# Altium schematic sheet power_supply.SchDoc
size A4
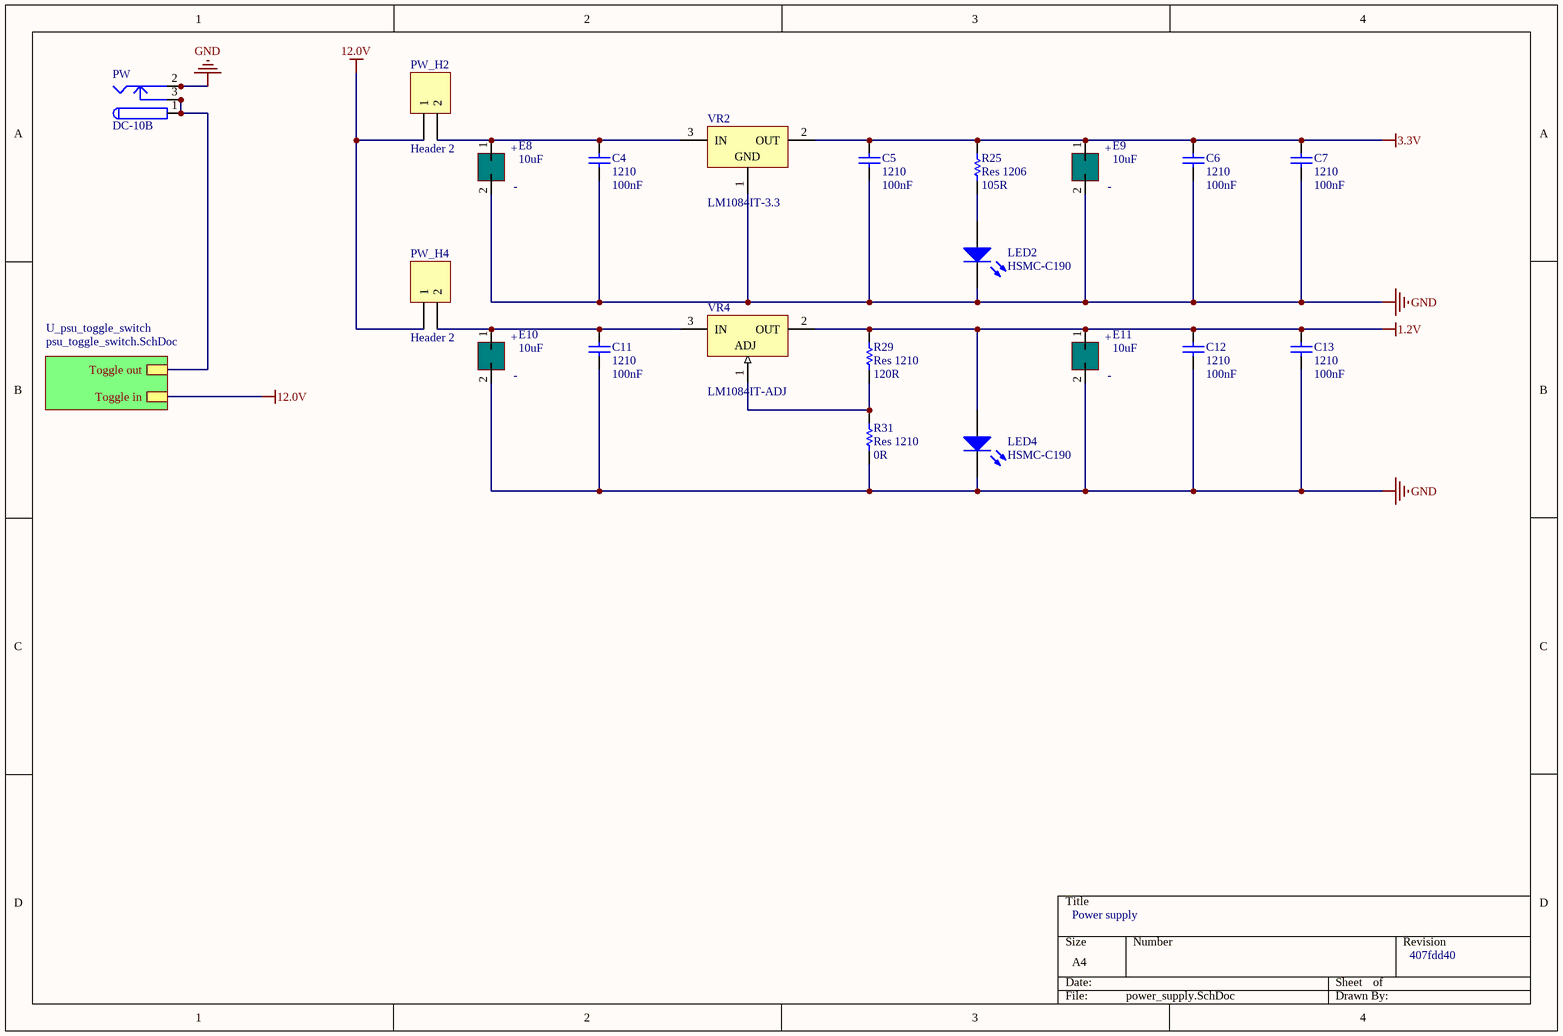
[diagram p0: power_supply.SchDoc]

## Parts
C4  1210  value 100nF  [CAPC1210(3225)105_L]
C5  1210  value 100nF  [CAPC1210(3225)105_L]
C6  1210  value 100nF  [CAPC1210(3225)105_L]
C7  1210  value 100nF  [CAPC1210(3225)105_L]
C11  1210  value 100nF  [CAPC1210(3225)105_L]
C12  1210  value 100nF  [CAPC1210(3225)105_L]
C13  1210  value 100nF  [CAPC1210(3225)105_L]
E8  10uF  [cap_pol_size_B]
E9  10uF  [cap_pol_size_B]
E10  10uF  [cap_pol_size_B]
E11  10uF  [cap_pol_size_B]
LED2  HSMC-C190  [1.6X0.8X0.8]
LED4  HSMC-C190  [1.6X0.8X0.8]
PW  DC-10B  [KLD-0202]
PW_H2  Header 2  [HDR1X2]
PW_H4  Header 2  [HDR1X2]
R25  Res 1206  value 105R  [RESC1206(3216)_L]
R29  Res 1210  value 120R  [RESC1210(3225)_M]
R31  Res 1210  value 0R  [RESC1210(3225)_M]
VR2  LM1084IT-3.3  [T03B]
VR4  LM1084IT-ADJ  [T03B]

## Sub-sheets
U_psu_toggle_switch = psu_toggle_switch.SchDoc: Toggle in, Toggle out

## Nets
1.2V: C12.2 C13.2 E11.1 LED4.1(A) R29.2 VR4.2(OUT)
3.3V: C5.2 C6.2 C7.2 E9.1 R25.1 VR2.2(OUT)
12.0V: PW_H2.1 PW_H4.1 ; sheet U_psu_toggle_switch/Toggle in
GND: C4.1 C5.1 C6.1 C7.1 C11.1 C12.1 C13.1 E8.2 E9.2 E10.2 E11.2 LED2.2(K) LED4.2(K) PW.2 PW.2A PW.2B R31.1 VR2.1(GND)
NetC4_2: C4.2 E8.1 PW_H2.2 VR2.3(IN)
NetC11_2: C11.2 E10.1 PW_H4.2 VR4.3(IN)
NetLED2_1: LED2.1(A) R25.2
NetPW_1: PW.1 PW.1A PW.1B PW.3 PW.3A PW.3B ; sheet U_psu_toggle_switch/Toggle out
NetR29_1: R29.1 R31.2 VR4.1(ADJ)

## Notes on the sheet
- Power supply
- 407fdd40
- (in symbol CAP_POL_SIZE_B) +; -

## Library data of the parts
C4-C7 C11-C13 = CMP-1038-01663-1: CAP 100nF 100V ±5% 1210 (3225 Metric) Thickness 1.05mm SMD; Case-Metric: 3225; Max Thickness: 1.05 mm; Rated Voltage: 100 V; Tolerance: ±5%; Case-EIA: 1210; Technology: SMT
E8-E11 = CAP_POL_SIZE_B: size B series S type V capacitor, panasonic elec
LED2 LED4 = HSMC-C190: High Performance Chip LED, Red; LuminousIntensity: 25mcd (Minimum).; PCB_Layout: Complies with manufacturer's recommendation.; Published: 11-Dec-2002; DatasheetVersion: 11-Mar-2002; PackageVersion: Mar-2002; PackageReference: 1.6X0.8X0.8; Publisher: Altium Limited; PackageDescription: SM LED; 2 Flat Leads; LED_Colour: Red; ComponentLink1Description: Manufacturer Link; ComponentLink1URL: http://www.avagotech.com/; ComponentLink2Description: Datasheet; ComponentLink2URL: http://cp.literature.agilent.com/litweb/pdf/5988-5891EN.pdf
PW = PWR2.5: Low Voltage Power Supply Connector; Published: 17-Dec-2003; DatasheetDocument: 09-May-2002; Publisher: Altium Limited; ComponentLink1Description: Manufacturer Link; ComponentLink1URL: http://domino.kycon.com/internet/Products.html
PW_H2 PW_H4 = Header 2: Header, 2-Pin; LatestRevisionDate: 17-Jul-2002; LatestRevisionNote: Re-released for DXP Platform.; Publisher: Altium Limited
R25 = CMP-1014-00056-1: 105R 0.25W 5% 1206 (3216 Metric)  SMD; Case-Metric: 3216; Case-EIA: 1206; Technology: SMT; Tolerance: 5 %; Power: 0.25 W
R29 = CMP-1015-00405-1: 120R 0.5W 1% 1210 (3225 Metric)  SMD; Case-Metric: 3225; Case-EIA: 1210; Technology: SMT; Tolerance: 1 %; Power: 0.5 W
R31 = CMP-1015-00405-1: 0R 0.5W 1% 1210 (3225 Metric)  SMD; Case-Metric: 3225; Case-EIA: 1210; Technology: SMT; Tolerance: 1 %; Power: 0.5 W
VR2 = LM1084IT-3.3: 5A Low Dropout Positive Regulators, 3-pin TO-220; Manufacturer: National Semiconductor; PackageTopMarking: NSUZXYTTE#*LM1084*IT-3.3; PowerWise: N; CompType: LDO IC; Published: 4-Dec-2008; DatasheetVersion: Jun-2005; PackageVersion: revL, Jan-1992; PackageReference: T03B; Publisher: Altium Limited; PackageDescription: TO-220, Molded, 3 Lead, Straight; Supplier 1: Farnell; Supplier Part Number 1: 4975467; PartNumber: LM1084IT-3.3; RoHS: N; PinCount: 3; ComponentLink1Description: LM1084 Datasheet; ComponentLink1URL: http://www.national.com/ds/LM/LM1084.pdf; ComponentLink2Description: LM1084 Web Page; ComponentLink2URL: http://www.national.com/pf/LM/LM1084.html; ComponentLink3Description: T03B Package Page; ComponentLink3URL: http://www.national.com/packaging/folders/t03b.html
VR4 = LM1084IT-ADJ: 5A Low Dropout Positive Regulators, 3-pin TO-220; Manufacturer: National Semiconductor; PackageTopMarking: NSUZXYTTE#*LM1084*IT-ADJ; PowerWise: N; CompType: LDO IC; Published: 4-Dec-2008; DatasheetVersion: Jun-2005; PackageVersion: revL, Jan-1992; PackageReference: T03B; Publisher: Altium Limited; PackageDescription: TO-220, Molded, 3 Lead, Straight; Supplier 1: Farnell; Supplier Part Number 1: 7610087; PartNumber: LM1084IT-ADJ; RoHS: N; PinCount: 3; ComponentLink1Description: LM1084 Datasheet; ComponentLink1URL: http://www.national.com/ds/LM/LM1084.pdf; ComponentLink2Description: LM1084 Web Page; ComponentLink2URL: http://www.national.com/pf/LM/LM1084.html; ComponentLink3Description: T03B Package Page; ComponentLink3URL: http://www.national.com/packaging/folders/t03b.html